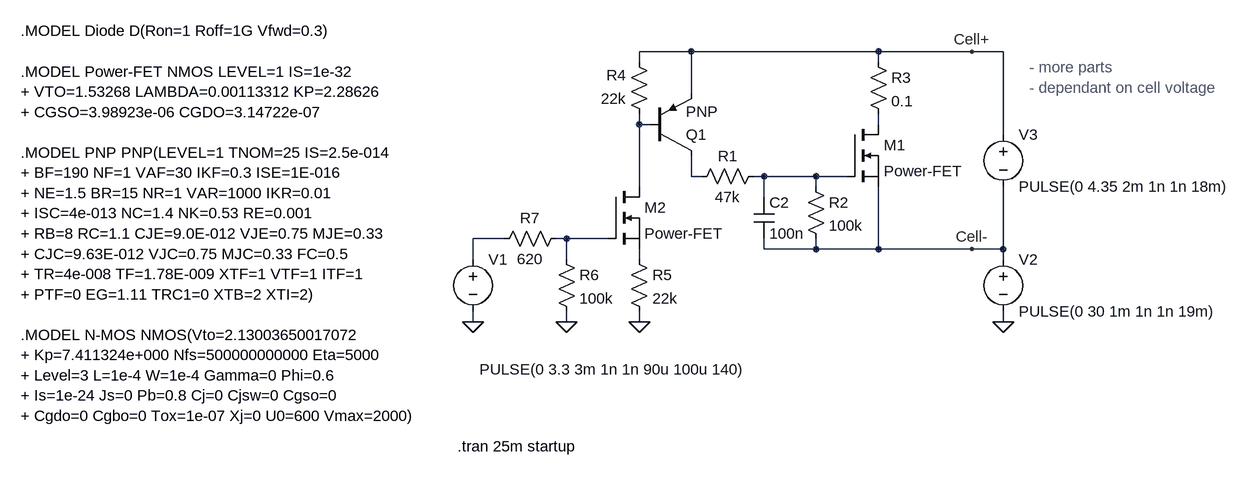
[diagram p0: schematic Level-Shifter_Transistor.asc]
Level-Shifter_Transistor.asc, the LTspice schematic file:
Version 4
SHEET 1 1812 1420
WIRE 416 -144 336 -144
WIRE 704 -144 416 -144
WIRE 848 -144 704 -144
WIRE 896 -144 848 -144
WIRE 336 -128 336 -144
WIRE 704 -128 704 -144
WIRE 416 -80 416 -144
WIRE 336 -32 336 -48
WIRE 352 -32 336 -32
WIRE 704 -32 704 -48
WIRE 896 -16 896 -144
WIRE 416 48 416 16
WIRE 432 48 416 48
WIRE 528 48 512 48
WIRE 608 48 528 48
WIRE 656 48 608 48
WIRE 336 64 336 -32
WIRE 608 64 608 48
WIRE 528 80 528 48
WIRE 128 144 80 144
WIRE 224 144 208 144
WIRE 288 144 224 144
WIRE 528 160 528 144
WIRE 608 160 608 144
WIRE 608 160 528 160
WIRE 704 160 704 64
WIRE 704 160 608 160
WIRE 848 160 704 160
WIRE 896 160 896 64
WIRE 896 160 848 160
WIRE 80 176 80 144
WIRE 224 176 224 144
WIRE 336 176 336 160
WIRE 896 176 896 160
WIRE 80 272 80 256
WIRE 224 272 224 256
WIRE 336 272 336 256
WIRE 896 272 896 256
FLAG 80 272 0
FLAG 896 272 0
FLAG 848 160 Cell-
FLAG 848 -144 Cell+
FLAG 336 272 0
FLAG 224 272 0
SYMBOL voltage 80 160 R0
WINDOW 123 0 0 Left 0
WINDOW 39 24 124 Left 2
WINDOW 3 10 185 Left 2
SYMATTR Value PULSE(0 3.3 3m 1n 1n 90u 100u 140)
SYMATTR InstName V1
SYMBOL voltage 896 160 R0
WINDOW 123 0 0 Left 0
WINDOW 39 0 0 Left 0
SYMATTR InstName V2
SYMATTR Value PULSE(0 30 1m 1n 1n 19m)
SYMBOL voltage 896 -32 R0
WINDOW 123 0 0 Left 0
WINDOW 39 0 0 Left 0
SYMATTR InstName V3
SYMATTR Value PULSE(0 4.35 2m 1n 1n 18m)
SYMBOL nmos 656 -32 R0
SYMATTR InstName M1
SYMATTR Value Power-FET
SYMBOL cap 512 80 R0
SYMATTR InstName C2
SYMATTR Value 100n
SYMBOL res 592 48 R0
SYMATTR InstName R2
SYMATTR Value 100k
SYMBOL res 688 -144 R0
SYMATTR InstName R3
SYMATTR Value 0.1
SYMBOL pnp 352 16 M180
SYMATTR InstName Q1
SYMBOL res 416 64 R270
WINDOW 0 32 56 VTop 2
WINDOW 3 0 56 VBottom 2
SYMATTR InstName R1
SYMATTR Value 47k
SYMBOL res 352 -32 R180
WINDOW 0 36 76 Left 2
WINDOW 3 36 40 Left 2
SYMATTR InstName R4
SYMATTR Value 22k
SYMBOL res 320 160 R0
SYMATTR InstName R5
SYMATTR Value 22k
SYMBOL res 208 160 R0
SYMATTR InstName R6
SYMATTR Value 100k
SYMBOL nmos 288 64 R0
SYMATTR InstName M2
SYMATTR Value Power-FET
SYMBOL res 224 128 R90
WINDOW 0 0 56 VBottom 2
WINDOW 3 32 56 VTop 2
SYMATTR InstName R7
SYMATTR Value 620
TEXT 56 464 Left 2 !.tran 25m startup
TEXT 936 -120 Left 2 ;- more parts\n- dependant on cell voltage
TEXT -616 -176 Left 2 !.MODEL Diode D(Ron=1 Roff=1G Vfwd=0.3)\n \n.MODEL Power-FET NMOS LEVEL=1 IS=1e-32\n+ VTO=1.53268 LAMBDA=0.00113312 KP=2.28626\n+ CGSO=3.98923e-06 CGDO=3.14722e-07\n \n.MODEL PNP PNP(LEVEL=1 TNOM=25 IS=2.5e-014 \n+ BF=190 NF=1 VAF=30 IKF=0.3 ISE=1E-016 \n+ NE=1.5 BR=15 NR=1 VAR=1000 IKR=0.01 \n+ ISC=4e-013 NC=1.4 NK=0.53 RE=0.001 \n+ RB=8 RC=1.1 CJE=9.0E-012 VJE=0.75 MJE=0.33 \n+ CJC=9.63E-012 VJC=0.75 MJC=0.33 FC=0.5 \n+ TR=4e-008 TF=1.78E-009 XTF=1 VTF=1 ITF=1 \n+ PTF=0 EG=1.11 TRC1=0 XTB=2 XTI=2)\n \n.MODEL N-MOS NMOS(Vto=2.13003650017072 \n+ Kp=7.411324e+000 Nfs=500000000000 Eta=5000 \n+ Level=3 L=1e-4 W=1e-4 Gamma=0 Phi=0.6 \n+ Is=1e-24 Js=0 Pb=0.8 Cj=0 Cjsw=0 Cgso=0 \n+ Cgdo=0 Cgbo=0 Tox=1e-07 Xj=0 U0=600 Vmax=2000)

The netlist it stands for:
* Level-Shifter_Transistor.asc
V1 N005 0 PULSE(0 3.3 3m 1n 1n 90u 100u 140)
V2 Cell- 0 PULSE(0 30 1m 1n 1n 19m)
V3 Cell+ Cell- PULSE(0 4.35 2m 1n 1n 18m)
M1 N002 N004 Cell- Cell- Power-FET
C2 N004 Cell- 100n
R2 N004 Cell- 100k
R3 Cell+ N002 0.1
Q1 N003 N001 Cell+ 0 PNP
R1 N003 N004 47k
R4 N001 Cell+ 22k
R5 N007 0 22k
R6 N006 0 100k
M2 N001 N006 N007 N007 Power-FET
R7 N006 N005 620
.model NPN NPN
.model PNP PNP
.lib standard.bjt
.model NMOS NMOS
.model PMOS PMOS
.lib standard.mos
.tran 25m startup
* - more parts
* - dependant on cell voltage
.MODEL Diode D(Ron=1 Roff=1G Vfwd=0.3)
.MODEL Power-FET NMOS LEVEL=1 IS=1e-32
+ VTO=1.53268 LAMBDA=0.00113312 KP=2.28626
+ CGSO=3.98923e-06 CGDO=3.14722e-07
.MODEL PNP PNP(LEVEL=1 TNOM=25 IS=2.5e-014
+ BF=190 NF=1 VAF=30 IKF=0.3 ISE=1E-016
+ NE=1.5 BR=15 NR=1 VAR=1000 IKR=0.01
+ ISC=4e-013 NC=1.4 NK=0.53 RE=0.001
+ RB=8 RC=1.1 CJE=9.0E-012 VJE=0.75 MJE=0.33
+ CJC=9.63E-012 VJC=0.75 MJC=0.33 FC=0.5
+ TR=4e-008 TF=1.78E-009 XTF=1 VTF=1 ITF=1
+ PTF=0 EG=1.11 TRC1=0 XTB=2 XTI=2)
.MODEL N-MOS NMOS(Vto=2.13003650017072
+ Kp=7.411324e+000 Nfs=500000000000 Eta=5000
+ Level=3 L=1e-4 W=1e-4 Gamma=0 Phi=0.6
+ Is=1e-24 Js=0 Pb=0.8 Cj=0 Cjsw=0 Cgso=0
+ Cgdo=0 Cgbo=0 Tox=1e-07 Xj=0 U0=600 Vmax=2000)
.backanno
.end